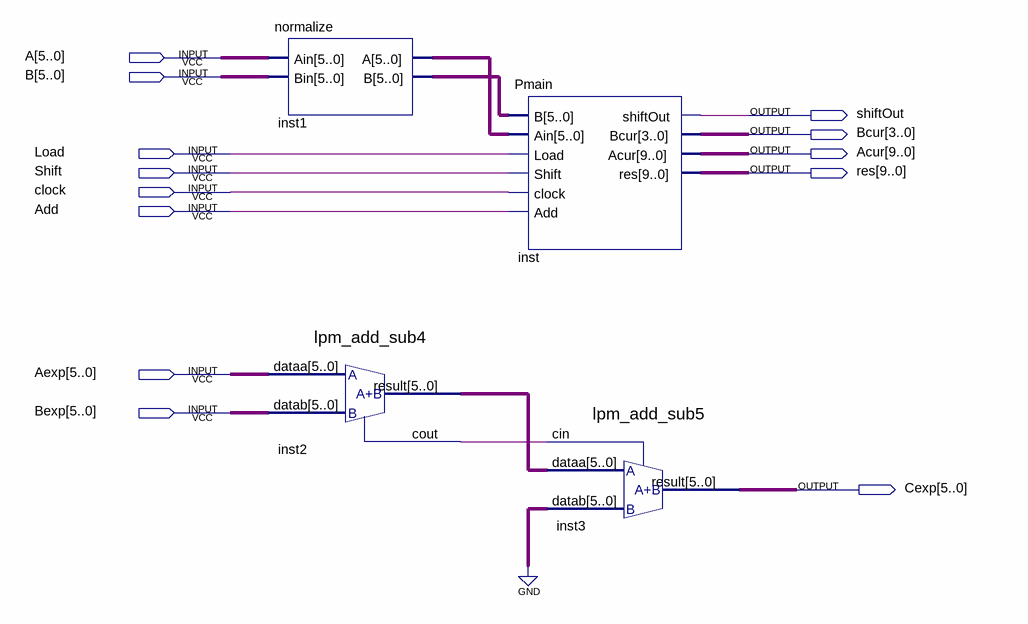
[diagram p0: schematic sheet]
// Quartus schematic normMain.bdf as structural Verilog: 4 symbols, 13 pins
module normMain (
  input  [5:0] A,
  input  [5:0] B,
  input  Load,
  input  Shift,
  input  clock,
  input  Add,
  input  [5:0] Aexp,
  input  [5:0] Bexp,
  output shiftOut,
  output [3:0] Bcur,
  output [9:0] Acur,
  output [9:0] res,
  output [5:0] Cexp
);

  wire inst2_cout;
  wire [5:0] inst1_a, inst1_b, inst2_result;

  normalize inst1 (.Ain(A), .Bin(B), .A(inst1_a), .B(inst1_b));
  lpm_add_sub4 inst2 (.dataa(Aexp), .datab(Bexp), .result(inst2_result), .cout(inst2_cout));
  Pmain inst (
    .B(inst1_b), .Ain(inst1_a), .Load(Load), .Shift(Shift), .clock(clock), .Add(Add), .shiftOut(shiftOut),
    .Bcur(Bcur), .Acur(Acur), .res(res));
  lpm_add_sub5 inst3 (.dataa(inst2_result), .datab({6{1'b0}}), .cin(inst2_cout), .result(Cexp));
endmodule
